# EAGLE design H-bridge-controller-board (EAGLE 8.4.3)
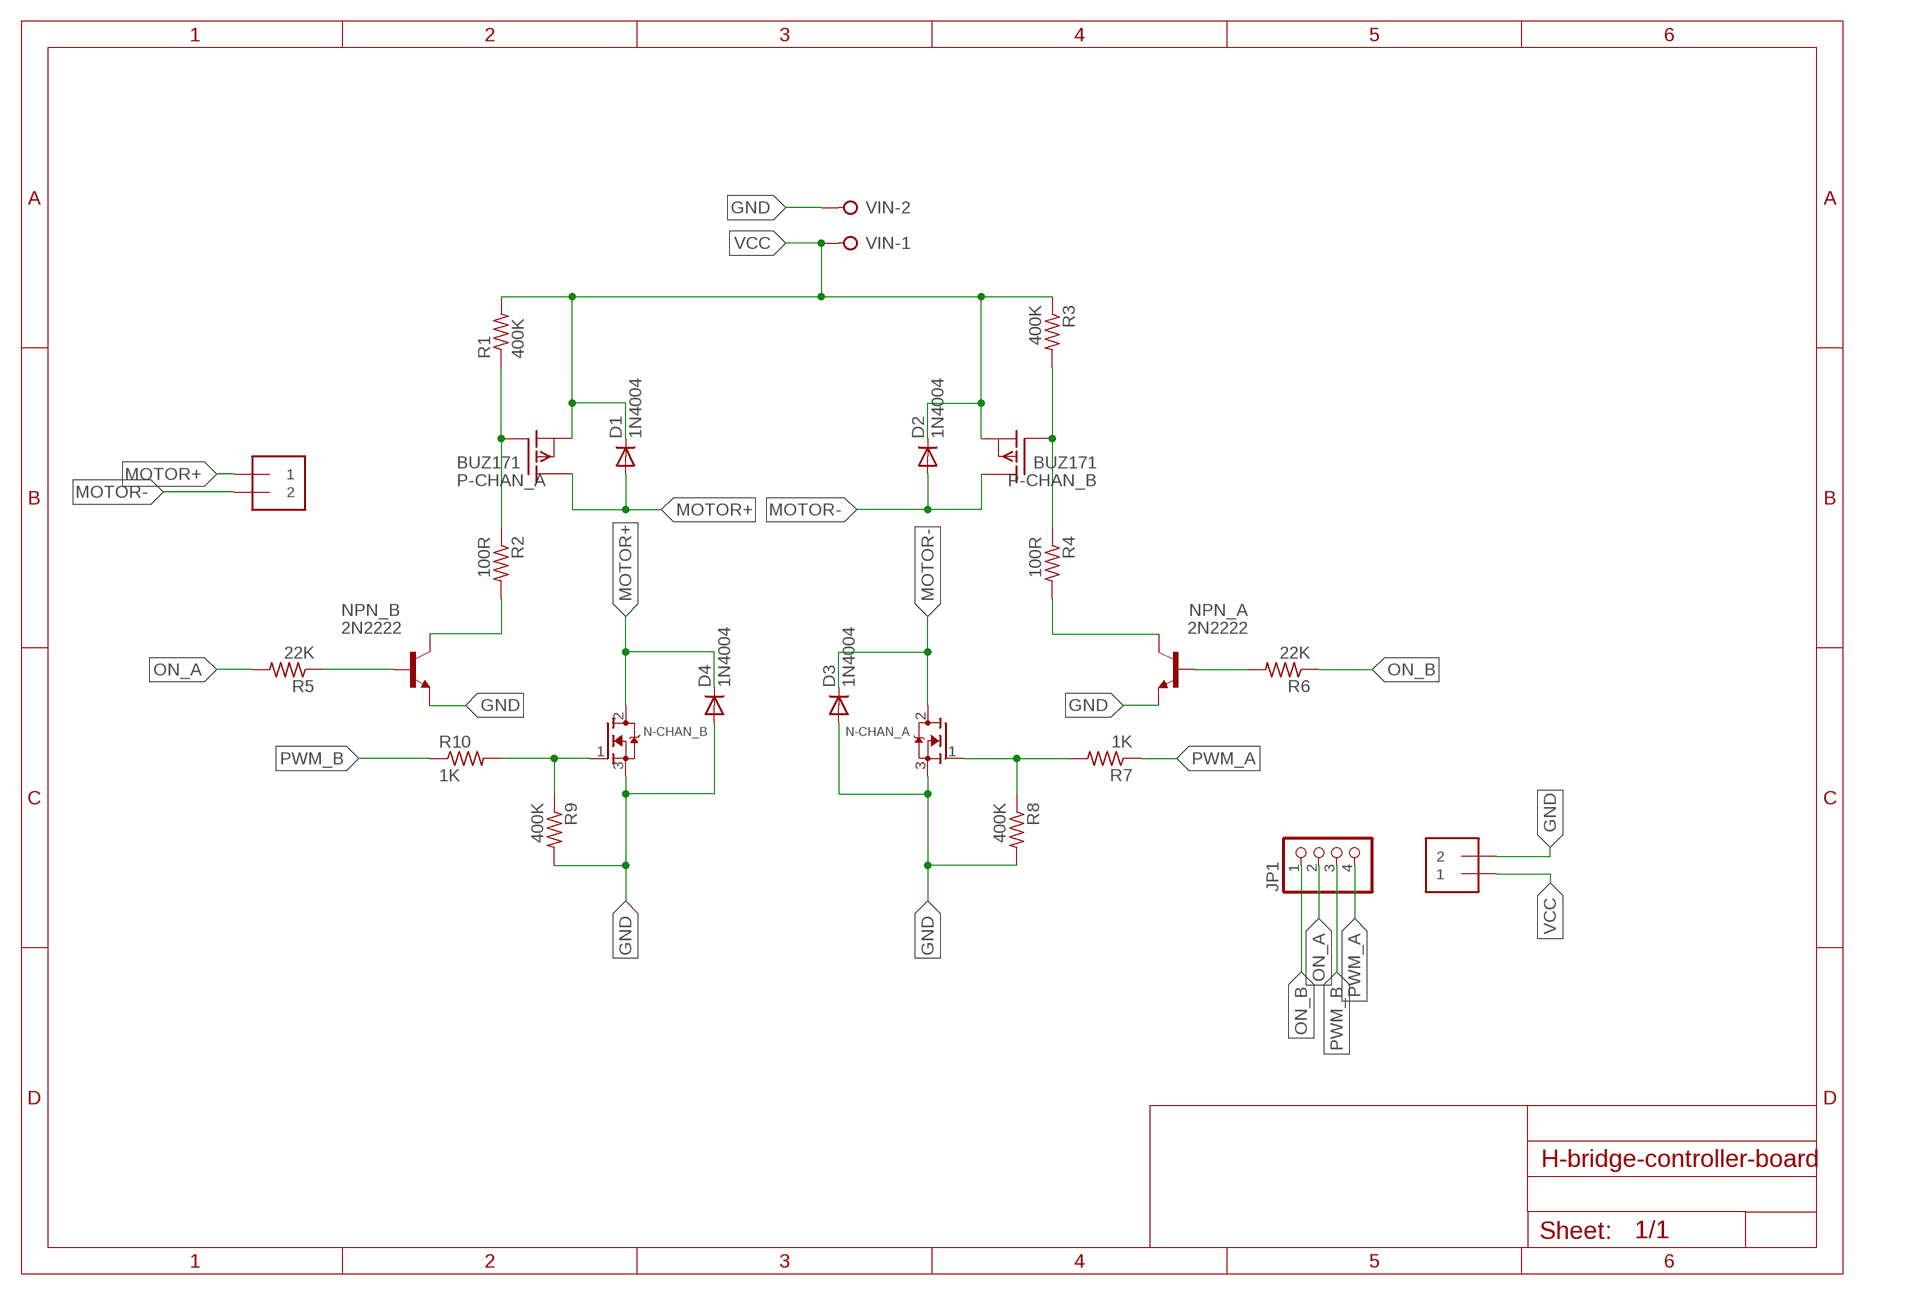
[diagram p0: schematic, sheet 1]

## Parts
D1  1N4004  [DO41-10]
D2  1N4004  [DO41-10]
D3  1N4004  [DO41-10]
D4  1N4004  [DO41-10]
JP1  PINHD-1X4  [1X04]
MOTOR_IN  1X2-3.5MM  [1X2-3.5MM]
N-CHAN_A  MOSFET-NGDS_TO220V  [TO220V]
N-CHAN_B  MOSFET-NGDS_TO220V  [TO220V]
NPN_A  2N2222  [TO92-EBC-OVAL]
NPN_B  2N2222  [TO92-EBC-OVAL]
P-CHAN_A  BUZ171  [TO220]
P-CHAN_B  BUZ171  [TO220]
R1  400K  RES-US1206FAB  [R1206FAB]
R2  100R  RES-US1206FAB  [R1206FAB]
R3  400K  RES-US1206FAB  [R1206FAB]
R4  100R  RES-US1206FAB  [R1206FAB]
R5  22K  RES-US1206FAB  [R1206FAB]
R6  22K  RES-US1206FAB  [R1206FAB]
R7  1K  RES-US1206FAB  [R1206FAB]
R8  400K  RES-US1206FAB  [R1206FAB]
R9  400K  RES-US1206FAB  [R1206FAB]
R10  1K  RES-US1206FAB  [R1206FAB]
VIN  W237-02P  [W237-132]
VOUT  1X2-3.5MM  [1X2-3.5MM]

## Nets
GND: D3.A D4.A N-CHAN_A.3(S) N-CHAN_B.3(S) NPN_A.E NPN_B.E R8.2 R9.2 VIN.2 VOUT.2
MOTOR+: D1.A D4.C MOTOR_IN.1 N-CHAN_B.2(D) P-CHAN_A.2(D)
MOTOR-: D2.A D3.C MOTOR_IN.2 N-CHAN_A.2(D) P-CHAN_B.2(D)
N$1: P-CHAN_A.1(G) R1.1 R2.1
N$2: P-CHAN_B.1(G) R3.2 R4.1
N$3: NPN_B.C R2.2
N$4: NPN_B.B R5.1
N$5: NPN_A.C R4.2
N$6: NPN_A.B R6.2
N$11: N-CHAN_B.1(G) R9.1 R10.2
N$13: N-CHAN_A.1(G) R7.2 R8.1
ON_A: JP1.2 R5.2
ON_B: JP1.1 R6.1
PWM_A: JP1.4 R7.1
PWM_B: JP1.3 R10.1
VCC: D1.C D2.C P-CHAN_A.3(S) P-CHAN_B.3(S) R1.2 R3.1 VIN.1 VOUT.1

## Library data of the parts
D1-D4 = adafruit:1N4004: DIODE General purpose 1N400x type rectifier (With bigger pads) http://www.ladyada.net/library/pcb/eaglelibrary.html
JP1 = pinhead:PINHD-1X4: PIN HEADER
MOTOR_IN VOUT = adafruit:1X2: 3.5mm Terminal block http://www.ladyada.net/library/pcb/eaglelibrary.html
N-CHAN_A N-CHAN_B = adafruit:MOSFET-N: N-Channel Mosfet 2N7002E - 60V 260mA SOT23 [Digikey: 2N7002ET1GOSTR-ND] - REEL BSH103 - 30V 850mA SOT23 [Digikey: 568-5013-1-ND]
NPN_A NPN_B = adafruit:2N2222: NPN TRANSISTOR Big oval pads
P-CHAN_A P-CHAN_B = transistor-fet:BUZ171: P-Channel Enhancement MOSFET -50V; 7A; 0,4Ohm
R1-R10 = fablab:RES-US: Resistor (US Symbol) Variants with postfix FAB are widened to allow the routing of internal traces
VIN = con-wago-508:W237-02P: WAGO SREW CLAMP; OC_FARNELL: unknown; OC_NEWARK: unknown

## Board
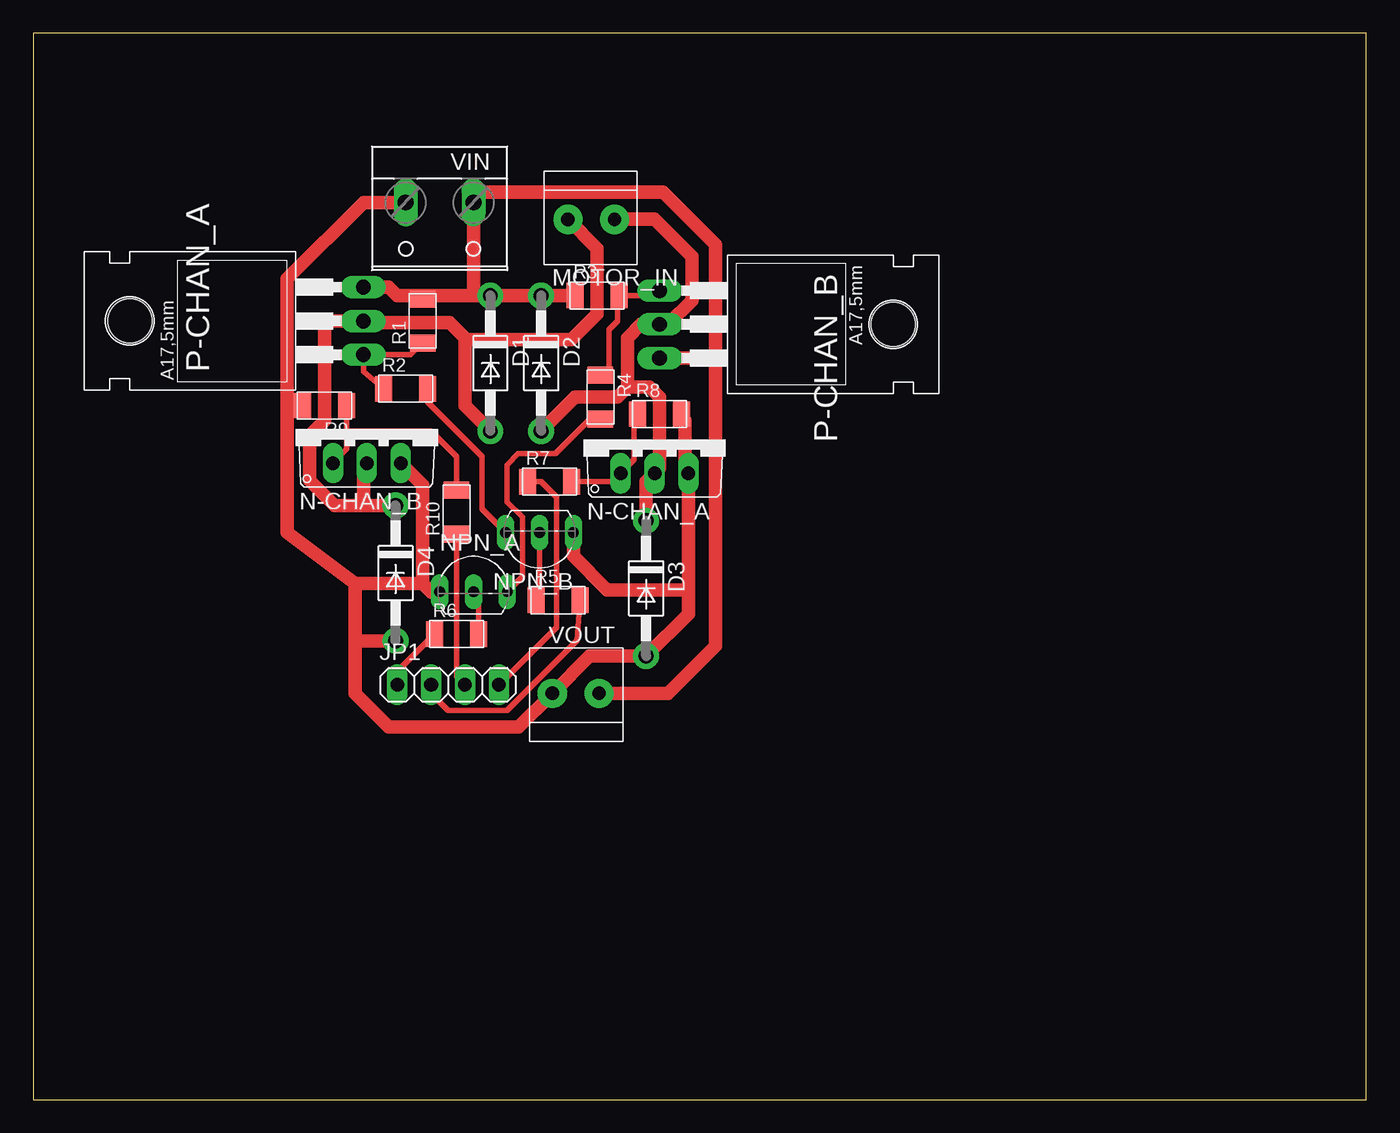
[diagram p1: board, top side]

Size 100 x 80 mm. Coordinates in mm from the lower left corner, seen from the top.
Outline: 0,0 100,0 100,80 0,80 0,0
Copper layers (1*16): Top 0.035mm / dielectric 1.5mm / Bottom 0.035mm
Design rules "default": minimum track width 6mil, minimum drill 0.35mm, track to track 6mil, track to pad 6mil, pad to pad 6mil, via to via 6mil, smd to smd 6mil, copper to edge 40mil, drill to drill 6mil, minimum pad ring 10mil, minimum via ring 8mil, stop-mask expansion 4mil, vias tented up to drill 0mil, thermal gap 10mil

### Footprints (pad centres in the part's own frame; a part is rotated, then mirrored left to right if it is on the bottom)
DO41-10 = drill 1.118 pad 1.93: A 5.08,0; C -5.08,0
1X04 = drill 1.016 long: 1 -3.81,0; 2 -1.27,0; 3 1.27,0; 4 3.81,0
1X2-3.5MM = drill 1 pad 2.184: 1 1.8,0; 2 -1.7,0
TO220V = drill 1.016 long: 1 -2.54,-2.54; 2 0,-2.54; 3 2.54,-2.54
TO92-EBC-OVAL = drill 0.813 long: B 0,-1.27; C 2.54,-1.27; E -2.54,-1.27
TO220 = drill 1.118 long: 1 -2.54,-6.35; 2 0,-6.35; 3 2.54,-6.35 | hole 3.302: 0,11.176
R1206FAB = smd 1.27 x 1.905: 1 -1.651,0; 2 1.651,0
W237-132 = drill 1.194 long: 1 -2.54,-0.635; 2 2.54,-0.635

### Placement (x,y rotation side)
D1  34.29,55.24 270 top
D2  38.1,55.24 270 top
D3  45.97,38.35 270 top
D4  27.18,39.5 270 top
JP1  31.11,31.11 0 top
MOTOR_IN  41.91,66.04 180 top
N-CHAN_A  46.61,49.53 0 top
N-CHAN_B  25.02,50.29 0 top
NPN_A  33.02,39.37 0 top
NPN_B  37.97,41.27 180 top
P-CHAN_A  18.41,58.42 90 top
P-CHAN_B  53.34,58.17 270 top
R1  29.21,58.42 90 top
R2  27.94,53.34 0 top
R3  42.29,60.33 0 top
R4  42.55,52.7 270 top
R5  39.37,37.47 0 top
R6  31.75,34.92 0 top
R7  38.73,46.35 0 top
R8  46.99,51.44 0 top
R9  21.84,52.07 180 top
R10  31.75,44.07 90 top
VIN  30.48,66.67 180 top
VOUT  40.64,30.48 0 top

### Tracks (layer width: path | path; a pad name or v marks a point on that pad's centre or on a via)
GND
  Top 0.406: 27.11,35.05 D4.A | R8.2 48.9,50.95 | 48.9,47.62 49.15,47.37 N-CHAN_A.3
  Top 1.016: 49.15,38.23 N-CHAN_A.3 | 49.15,38.23 49.15,36.45 D3.A 41.73,33.27 VOUT.2 36.4,27.94 26.67,27.94 24.13,30.48 24.13,34.42 | 19.05,52.07 19.05,42.55 24.13,38.73 | 19.05,52.07 19.05,61.59 24.77,67.31 VIN.2 | 24.13,34.42 D4.A | N-CHAN_B.3 29.21,46.1 29.21,38.73 | 48.9,50.95 48.9,47.62 | 24.13,38.73 24.13,34.42 | 29.21,38.73 24.13,38.73 | 29.21,38.73 29.84,38.1 NPN_A.E | NPN_B.E 40.51,40.77 43.05,38.23 49.15,38.23 | R9.2 19.05,52.07
MOTOR+
  Top 0.305: 24.89,58.29 P-CHAN_A.2 | D1.A 34.04,50.16 | 32.38,57.02 32.38,57.15
  Top 1.016: 24.89,58.29 31.24,58.29 32.38,57.15 | D1.A 32.38,52.07 32.38,57.02 40.39,57.02 42.29,58.93 42.29,63.86 MOTOR_IN.1 | P-CHAN_A.2 22.23,58.42 21.84,58.04 21.84,50.93 20.73,49.81 20.73,46.46 22.61,44.58 24.77,44.58 | 24.77,44.58 D4.C | N-CHAN_B.2 24.77,47.5 24.77,44.58
MOTOR-
  Top 0.305: P-CHAN_B.2 47.62,58.17 | 43.56,65.99 MOTOR_IN.2 | N-CHAN_A.2 46.99,47.37
  Top 1.016: N-CHAN_A.2 45.97,46.35 D3.C | MOTOR_IN.2 46.61,66.04 49.4,63.25 49.4,59.94 47.62,58.17 | 46.99,47.37 46.99,52.7 46.23,53.47 44.58,53.47 | 44.58,53.47 44.58,57.15 45.59,58.17 P-CHAN_B.2 | D2.A 40.64,52.7 43.81,52.7 44.58,53.47
N$1
  Top 0.406: R2.1 24.77,54.61 P-CHAN_A.1 28.32,55.88 R1.1
N$2
  Top 0.305: 43.81,60.33 43.71,60.22 R3.2 | R4.1 43.18,54.76
  Top 0.406: P-CHAN_B.1 46.61,60.33 R3.2 | R3.2 43.81,60.33 | 43.18,54.76 43.18,57.78 43.81,58.42 43.81,60.2 R3.2
N$3
  Top 0.406: NPN_B.C 33.66,44.32 33.66,48.26 29.59,52.32 R2.2
N$4
  Top 0.406: NPN_B.B 37.97,38.08 R5.1
N$5
  Top 0.406: R4.2 42.01,51.28 39.18,48.45 36.39,48.45 35.56,47.62 35.56,44.83 36.7,43.69 36.7,39.24 NPN_A.C
N$6
  Top 0.406: NPN_A.B 33.4,37.72 R6.2
N$11
  Top 0.305: N-CHAN_B.1 22.48,47.88
  Top 0.406: R9.1 23.52,50.16 | 23.52,50.16 23.52,48.79 N-CHAN_B.1 | 23.52,50.16 29.84,50.16 31.75,48.26 R10.2
N$13
  Top 0.305: 45.09,51.05 45.47,51.44 R8.1
  Top 0.406: R7.2 43.43,46.35 N-CHAN_A.1 45.09,48.01 45.09,51.05
ON_A
  Top 0.406: JP1.2 29.84,30.48 31.11,29.21 35.56,29.21 40.79,34.44 R5.2
ON_B
  Top 0.406: R6.1 27.3,32.13 JP1.1
PWM_A
  Top 0.406: JP1.4 39.24,35.43 39.24,45.21 38.1,46.35 R7.1
PWM_B
  Top 0.406: JP1.3 31.75,31.75 R10.1
VCC
  Top 0.406: R1.2 29.84,60.33
  Top 1.016: 51.18,55.63 51.18,64.14 47.24,68.07 33.78,68.07 VIN.1 33.02,60.33 | 51.18,55.63 51.18,34.04 47.62,30.48 VOUT.1 | P-CHAN_B.3 51.18,55.63 | P-CHAN_A.3 26.67,60.96 27.3,60.33 29.84,60.33 33.02,60.33 | 33.02,60.33 D1.C D2.C R3.1